# EAGLE schematic GiGaPower (EAGLE 7.1.0)
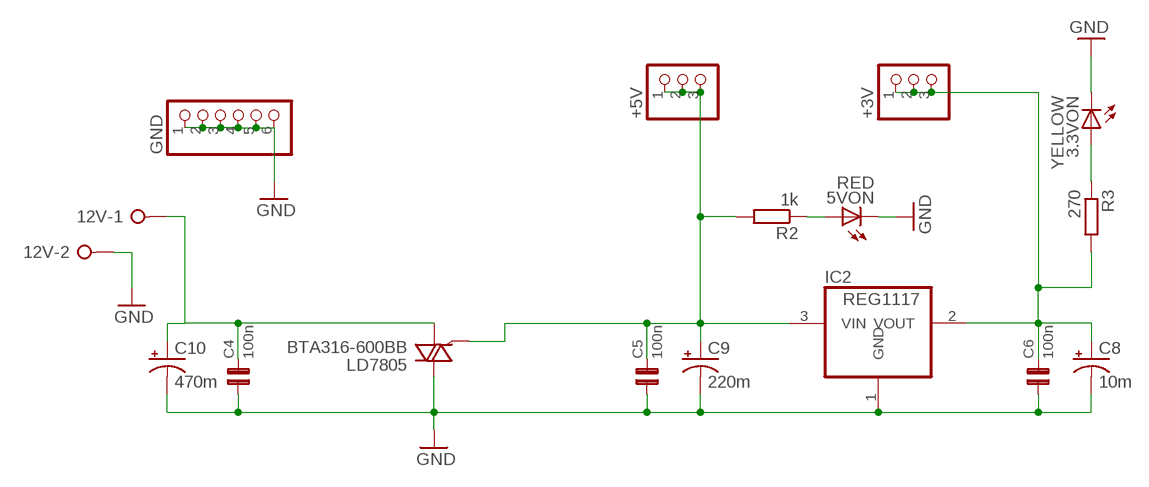
[diagram p0: schematic, sheet 1]

## Parts
3.3VON  YELLOW  LEDCHIPLED_1206  [CHIPLED_1206]
5VON  RED  LEDCHIPLED_1206  [CHIPLED_1206]
12V  W237-02P  [W237-132]
+3V  PINHD-1X3  [1X03]
+5V  PINHD-1X3  [1X03]
C4  100n  C1206  [1206]
C5  100n  C1206  [1206]
C6  100n  C1206  [1206]
C8  10m  CPOL-USUD-4X5,8  [UD-4X5,8_NICHICON]
C9  220m  CPOL-USUD-6,3X7,7  [UD-6,3X7,7_NICHICON]
C10  470m  CPOL-USUD-10X10  [UD-10X10_NICHICON]
GND  PINHD-1X6  [1X06]
IC2  REG1117  [SOT223]
LD7805  BTA316-600BB  [SOT404]
R2  1k  R-EU_R1206  [R1206]
R3  270  R-EU_R1206  [R1206]

## Nets
+3: +3V.1 +3V.2 +3V.3 C6.2 C8.+ IC2.2(VOUT) R3.2
+3LED: 3.3VON.A R3.1
+5: +5V.1 +5V.2 +5V.3 C5.2 C9.+ IC2.3(VIN) LD7805.3(G) R2.2
+5LED: 5VON.A R2.1
+12: 12V.1 C4.2 C10.+ LD7805.1(CM)
GND: 3.3VON.C 5VON.C 12V.2 C4.1 C5.1 C6.1 C8.- C9.- C10.- GND.1 GND.2 GND.3 GND.4 GND.5 GND.6 IC2.1(GND) LD7805.MB(LD)

## Library data of the parts
3.3VON 5VON = led:LED: LED OSRAM: - CHIPLED LG R971, LG N971, LY N971, LG Q971, LY Q971, LO R971, LY R971 LH N974, LH R974 LS Q976, LO Q976, LY Q976 LO Q996 - Hyper CHIPLED LW Q18S LB Q993, LB Q99A, LB R99A - SideLED LS A670, LO A670, LY A670, LG A670, LP A670 LB A673, LV A673, LT A673, LW A673 LH A674 LY A675 LS A676, LA A676, LO A676, LY A676, LW A676 LS A679, LY A679, LG A679 - Hyper Micro SIDELED® LS Y876, LA Y876, LO Y876, LY Y876 LT Y87S - SmartLED LW L88C, LW L88S LB L89C, LB L89S, LG L890 LS L89K, LO L89K, LY L89K LS L896, LA L896, LO L896, LY L896 - TOPLED LS T670, LO T670, LY T670, LG T670, LP T670 LSG T670, LSP T670, LSY T670, LOP T670, LYG T670 LG T671, LOG T671, LSG T671 LB T673, LV T673, LT T673, LW T673 LH T674 LS T676, LA T676, LO T676, LY T676, LB T676, LH T676, LSB T676, LW T676 LB T67C, LV T67C, LT T67C, LS T67K, LO T67K, LY T67K, LW E67C LS E67B, LA E67B, LO E67B, LY E67B, LB E67C, LV E67C, LT E67C LW T67C LS T679, LY T679, LG T679 LS T770, LO T770, LY T770, LG T770, LP T770 LB T773, LV T773, LT T773, LW T773 LH T774 LS E675, LA E675, LY E675, LS T675 LS T776, LA T776, LO T776, LY T776, LB T776 LHGB T686 LT T68C, LB T68C - Hyper Mini TOPLED® LB M676 - Mini TOPLED Santana® LG M470 LS M47K, LO M47K, LY M47K Source: http://www.osram.convergy.de LUXEON: - LUMILED® LXK2-PW12-R00, LXK2-PW12-S00, LXK2-PW14-U00, LXK2-PW14-V00 LXK2-PM12-R00, LXK2-PM12-S00, LXK2-PM14-U00 LXK2-PE12-Q00, LXK2-PE12-R00, LXK2-PE12-S00, LXK2-PE14-T00, LXK2-PE14-U00 LXK2-PB12-K00, LXK2-PB12-L00, LXK2-PB12-M00, LXK2-PB14-N00, LXK2-PB14-P00, LXK2-PB14-Q00 LXK2-PR12-L00, LXK2-PR12-M00, LXK2-PR14-Q00, LXK2-PR14-R00 LXK2-PD12-Q00, LXK2-PD12-R00, LXK2-PD12-S00 LXK2-PH12-R00, LXK2-PH12-S00 LXK2-PL12-P00, LXK2-PL12-Q00, LXK2-PL12-R00 Source: www.luxeon.com KINGBRIGHT: KA-3528ASYC Source: www.kingbright.com
12V = con-wago-508:W237-02P: WAGO SREW CLAMP; OC_FARNELL: unknown; OC_NEWARK: unknown
+3V +5V = pinhead:PINHD-1X3: PIN HEADER
C4-C6 = capsmd:C1206
C8-C10 = rcl:CPOL-US: POLARIZED CAPACITOR, American symbol
GND = pinhead:PINHD-1X6: PIN HEADER
IC2 = burr-brown:REG1117: 800mA and 1A Low Dropout (LDO) Positive Regulator 1.8V, 2.5V, 2.85V, 3.3V, 5V, and Adj; MPN: REG1117; OC_FARNELL: 1097566; OC_NEWARK: 14P6981
LD7805 = nxp_60:BTA316: Planar passivated high commutation three quadrant triac in a SOT78 plastic package intended for use in circuits where high static and dynamic dV/dt and high dI/dt can occur AAL Eindhoven MV+ MK; 12NC: 9340 601 04118
R2 R3 = rcl:R-EU_: RESISTOR, European symbol